# Altium schematic sheet Superseal.SchDoc
size A
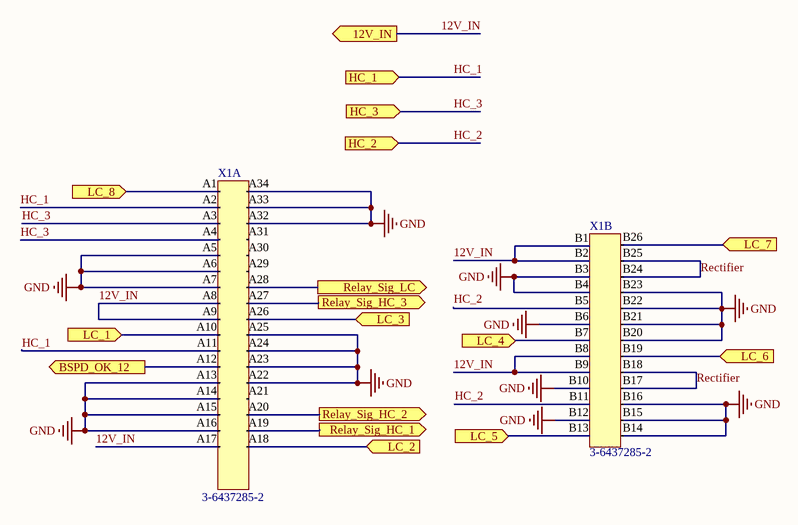
[diagram p0: Superseal.SchDoc]

## Parts
X1  3-6437285-2  [SUPERSEAL 60POS 90Deg]  (parts A,B of 2)

## Ports
12V_IN (out), BSPD_OK_12 (out), HC_1 (in), HC_2 (in), HC_3 (in), LC_1 (in), LC_2 (in), LC_3 (in), LC_4 (in), LC_5 (in), LC_6 (in), LC_7 (in), LC_8 (in), Relay_Sig_HC_1 (out), Relay_Sig_HC_2 (out), Relay_Sig_HC_3 (out), Relay_Sig_LC (out)

## Nets
GND: X1.A5 X1.A6 X1.A7 X1.A13 X1.A14 X1.A15 X1.A16 X1.A22 X1.A23 X1.A24 X1.A25 X1.A32 X1.A33 X1.A34 X1.B3 X1.B4 X1.B6 X1.B10 X1.B12 X1.B14 X1.B15 X1.B16 X1.B20 X1.B21 X1.B22 X1.B23
12V_IN: X1.A8 X1.A9 X1.A17 X1.B1 X1.B2 X1.B8 X1.B9 ; port 12V_IN
BSPD_OK_12: X1.A12 ; port BSPD_OK_12
HC_1: X1.A2 X1.A11 ; port HC_1
HC_2: X1.B5 X1.B11 ; port HC_2
HC_3: X1.A3 X1.A4 ; port HC_3
LC_1: X1.A10 ; port LC_1
LC_2: X1.A18 ; port LC_2
LC_3: X1.A26 ; port LC_3
LC_4: X1.B7 ; port LC_4
LC_5: X1.B13 ; port LC_5
LC_6: X1.B19 ; port LC_6
LC_7: X1.B26 ; port LC_7
LC_8: X1.A1 ; port LC_8
Rectifier: X1.B17 X1.B18 X1.B24 X1.B25
Relay_Sig_HC_1: X1.A19 ; port Relay_Sig_HC_1
Relay_Sig_HC_2: X1.A20 ; port Relay_Sig_HC_2
Relay_Sig_HC_3: X1.A27 ; port Relay_Sig_HC_3
Relay_Sig_LC: X1.A28 ; port Relay_Sig_LC

Not connected (* = marked no-connect by the designer): X1 A21 A29 A30 A31

## Library data of the parts
X1 = 3: 90 Degree; Manufacturer_id: 1; idConn: 3; Name: AMP Superseal 60POS 90Deg; Value: CONN; Num_Contacts: 60; Num_Rows: 4; Pitch: 3 mm; MfrPartNo: 3-6437285-2; Drawer_id: 1; Link: https://www.te.com/usa-en/product-3-6437285-2.html; ComponentLink1Description: Datasheet